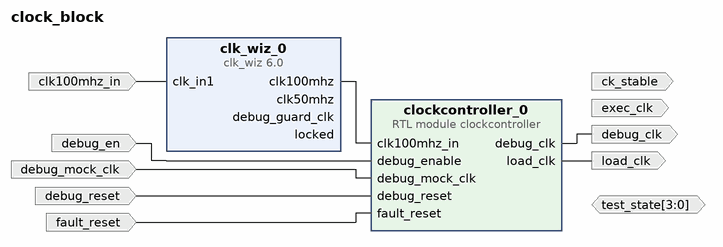
[diagram p0: block diagram of the top level]
# Vivado block design clock_block, xc7a35ticsg324-1L, Vivado 2024.1
create_bd_design clock_block

create_bd_port -dir I -type clk clk100mhz_in
set_property -dict {CONFIG.FREQ_HZ 100000000} [get_bd_ports clk100mhz_in]
create_bd_port -dir I -type rst fault_reset
create_bd_port -dir I -type rst debug_reset
create_bd_port -dir I debug_en
create_bd_port -dir I -type clk debug_mock_clk
set_property -dict {CONFIG.FREQ_HZ 100000000} [get_bd_ports debug_mock_clk]
create_bd_port -dir O -type clk load_clk
create_bd_port -dir O -type clk exec_clk
create_bd_port -dir O -type clk debug_clk
create_bd_port -dir O ck_stable
create_bd_port -dir IO -from 3 -to 0 test_state

create_bd_cell -type ip -vlnv xilinx.com:ip:clk_wiz:6.0 clk_wiz_0
set_property -dict [list \
  CONFIG.CLKOUT2_JITTER 151.636 \
  CONFIG.CLKOUT2_PHASE_ERROR 98.575 \
  CONFIG.CLKOUT2_REQUESTED_OUT_FREQ 50.000 \
  CONFIG.CLKOUT2_USED true \
  CONFIG.CLKOUT3_JITTER 130.958 \
  CONFIG.CLKOUT3_PHASE_ERROR 98.575 \
  CONFIG.CLKOUT3_REQUESTED_PHASE 90.000 \
  CONFIG.CLKOUT3_USED true \
  CONFIG.CLK_OUT1_PORT clk100mhz \
  CONFIG.CLK_OUT2_PORT clk50mhz \
  CONFIG.CLK_OUT3_PORT debug_guard_clk \
  CONFIG.MMCM_CLKOUT1_DIVIDE 20 \
  CONFIG.MMCM_CLKOUT2_DIVIDE 10 \
  CONFIG.MMCM_CLKOUT2_PHASE 90.000 \
  CONFIG.NUM_OUT_CLKS 3 \
  CONFIG.USE_RESET false \
] [get_bd_cells clk_wiz_0]
create_bd_cell -type module -reference clockcontroller clockcontroller_0

# ---- connections ----

# net Net has one end: test_state
connect_bd_net [get_bd_ports clk100mhz_in] [get_bd_pins clk_wiz_0/clk_in1]
connect_bd_net [get_bd_pins clk_wiz_0/clk100mhz] [get_bd_pins clockcontroller_0/clk100mhz_in]
# net clk_wiz_0_clk50mhz has one end: clk_wiz_0/clk50mhz
# net clk_wiz_0_debug_guard_clk has one end: clk_wiz_0/debug_guard_clk
# net clk_wiz_0_locked has one end: clk_wiz_0/locked
# net clockcontroller_0_ck_stable has one end: ck_stable
connect_bd_net [get_bd_pins clockcontroller_0/debug_clk] [get_bd_ports debug_clk]
# net clockcontroller_0_exec_clk has one end: exec_clk
connect_bd_net [get_bd_pins clockcontroller_0/load_clk] [get_bd_ports load_clk]
connect_bd_net [get_bd_ports debug_en] [get_bd_pins clockcontroller_0/debug_enable]
connect_bd_net [get_bd_ports debug_mock_clk] [get_bd_pins clockcontroller_0/debug_mock_clk]
connect_bd_net [get_bd_ports debug_reset] [get_bd_pins clockcontroller_0/debug_reset]
connect_bd_net [get_bd_ports fault_reset] [get_bd_pins clockcontroller_0/fault_reset]

validate_bd_design
save_bd_design
